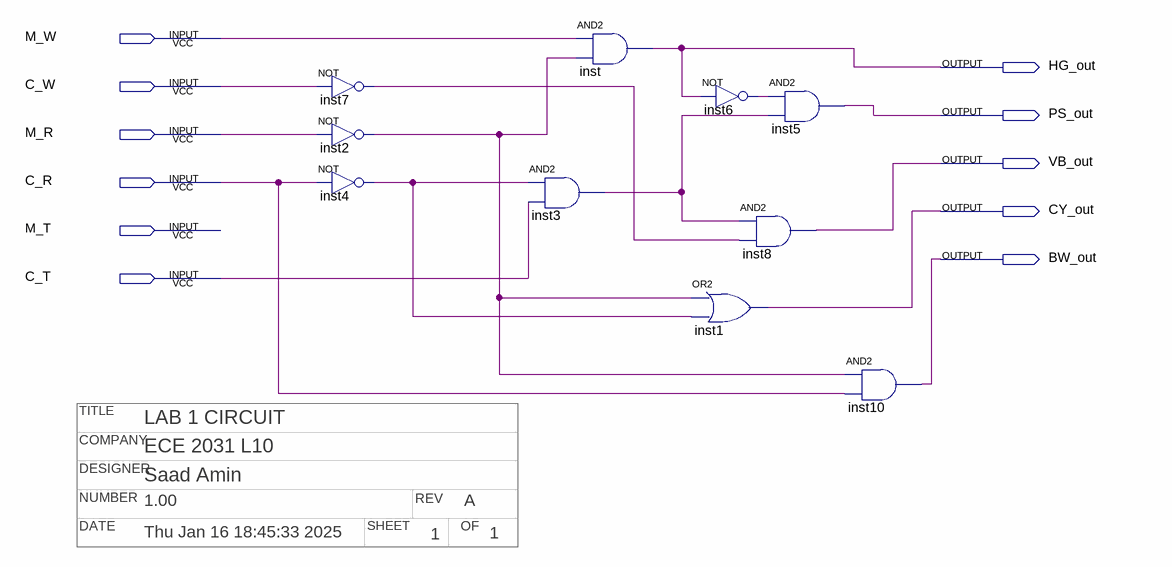
[diagram p0: schematic sheet]
// Quartus schematic ActivitySuggestions.bdf as structural Verilog: 10 symbols, 11 pins
// Title block: COMPANY: ECE 2031 L10; DATE: Thu Jan 16 18:45:33 2025; DESIGNER: Saad Amin; NUMBER: 1.00; OF: 1; REV: A; SHEET: 1; TITLE: LAB 1 CIRCUIT
module ActivitySuggestions (
  input  M_W,
  input  C_W,
  input  M_R,
  input  C_R,
  input  M_T,
  input  C_T,
  output HG_out,
  output PS_out,
  output VB_out,
  output CY_out,
  output BW_out
);

  wire inst2_out, inst3_out, inst4_out, inst6_out, inst7_out;

  not inst7 (inst7_out, C_W);
  not inst2 (inst2_out, M_R);
  not inst4 (inst4_out, C_R);
  and inst3 (inst3_out, inst4_out, C_T);
  and inst (HG_out, M_W, inst2_out);
  not inst6 (inst6_out, HG_out);
  or inst1 (CY_out, inst2_out, inst4_out);
  and inst5 (PS_out, inst6_out, inst3_out);
  and inst8 (VB_out, inst3_out, inst7_out);
  and inst10 (BW_out, inst2_out, C_R);
endmodule
